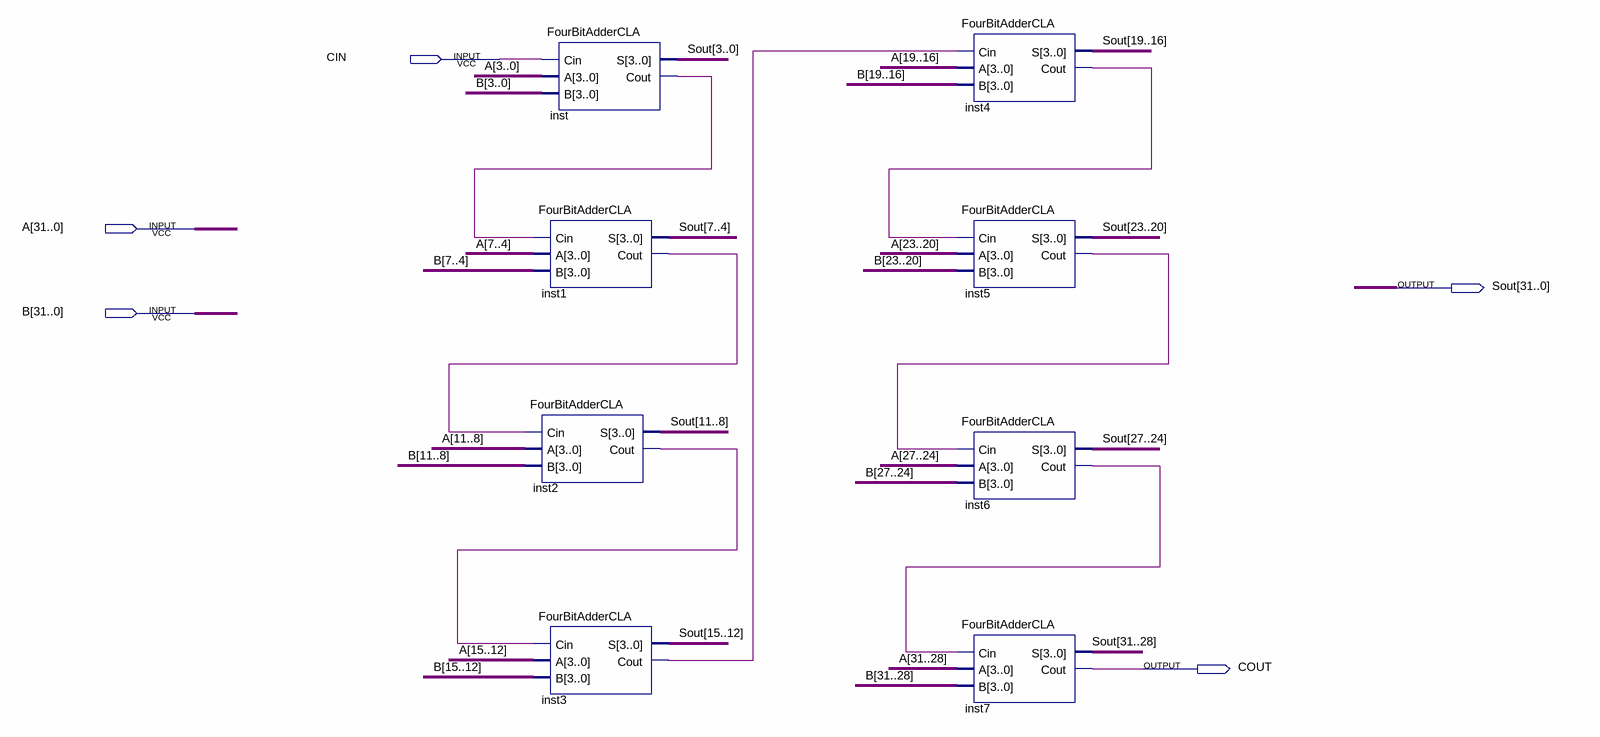
[diagram p0: schematic sheet]
// Quartus schematic ThirtytwoFullAdder.bdf as structural Verilog: 8 symbols, 5 pins
module ThirtytwoFullAdder (
  input  CIN,
  input  [31:0] A,
  input  [31:0] B,
  output [31:0] Sout,
  output COUT
);

  wire inst1_cout, inst2_cout, inst3_cout, inst4_cout, inst5_cout, inst6_cout, inst_cout;

  FourBitAdderCLA inst1 (.Cin(inst_cout), .A(A[7:4]), .B(B[7:4]), .S(Sout[7:4]), .Cout(inst1_cout));
  FourBitAdderCLA inst2 (.Cin(inst1_cout), .A(A[11:8]), .B(B[11:8]), .S(Sout[11:8]), .Cout(inst2_cout));
  FourBitAdderCLA inst3 (.Cin(inst2_cout), .A(A[15:12]), .B(B[15:12]), .S(Sout[15:12]), .Cout(inst3_cout));
  FourBitAdderCLA inst (.Cin(CIN), .A(A[3:0]), .B(B[3:0]), .S(Sout[3:0]), .Cout(inst_cout));
  FourBitAdderCLA inst4 (.Cin(inst3_cout), .A(A[19:16]), .B(B[19:16]), .S(Sout[19:16]), .Cout(inst4_cout));
  FourBitAdderCLA inst5 (.Cin(inst4_cout), .A(A[23:20]), .B(B[23:20]), .S(Sout[23:20]), .Cout(inst5_cout));
  FourBitAdderCLA inst6 (.Cin(inst5_cout), .A(A[27:24]), .B(B[27:24]), .S(Sout[27:24]), .Cout(inst6_cout));
  FourBitAdderCLA inst7 (.Cin(inst6_cout), .A(A[31:28]), .B(B[31:28]), .S(Sout[31:28]), .Cout(COUT));
endmodule
